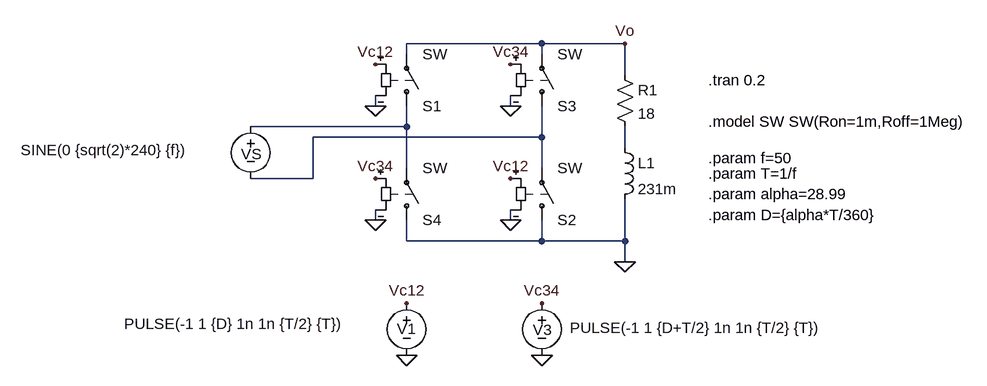
[diagram p0: schematic spfwcr-using-vcsw.asc]
spfwcr-using-vcsw.asc, the LTspice schematic file:
Version 4
SHEET 1 1700 680
WIRE 480 -48 272 -48
WIRE 608 -48 480 -48
WIRE 272 -32 272 -48
WIRE 480 -32 480 -48
WIRE 608 0 608 -48
WIRE 224 48 224 32
WIRE 432 48 432 32
WIRE 272 80 272 48
WIRE 272 80 32 80
WIRE 480 96 480 48
WIRE 480 96 128 96
WIRE 608 112 608 80
WIRE 272 144 272 80
WIRE 480 144 480 96
WIRE 128 160 128 96
WIRE 128 160 32 160
WIRE 224 224 224 208
WIRE 432 224 432 208
WIRE 272 256 272 224
WIRE 480 256 480 224
WIRE 480 256 272 256
WIRE 608 256 608 192
WIRE 608 256 480 256
WIRE 608 288 608 256
FLAG 608 288 0
FLAG 608 -48 Vo
FLAG 272 432 0
FLAG 272 352 Vc12
FLAG 224 48 0
FLAG 224 -16 Vc12
FLAG 432 160 Vc12
FLAG 432 224 0
FLAG 480 352 Vc34
FLAG 480 432 0
FLAG 432 -16 Vc34
FLAG 224 160 Vc34
FLAG 432 48 0
FLAG 224 224 0
SYMBOL voltage 32 64 R0
WINDOW 0 -15 58 Left 2
WINDOW 3 -354 52 Left 2
WINDOW 123 0 0 Left 0
WINDOW 39 0 0 Left 0
SYMATTR InstName VS
SYMATTR Value SINE(0 {sqrt(2)*240} {f})
SYMBOL res 592 -16 R0
SYMATTR InstName R1
SYMATTR Value 18
SYMBOL voltage 272 336 R0
WINDOW 3 -435 48 Left 2
WINDOW 123 0 0 Left 0
WINDOW 39 0 0 Left 0
WINDOW 0 -15 55 Left 2
SYMATTR Value PULSE(-1 1 {D} 1n 1n {T/2} {T})
SYMATTR InstName V1
SYMBOL voltage 480 336 R0
WINDOW 3 43 54 Left 2
WINDOW 0 -14 57 Left 2
WINDOW 123 0 0 Left 0
WINDOW 39 0 0 Left 0
SYMATTR Value PULSE(-1 1 {D+T/2} 1n 1n {T/2} {T})
SYMATTR InstName V3
SYMBOL ind 592 96 R0
SYMATTR InstName L1
SYMATTR Value 231m
SYMBOL sw 272 64 M180
SYMATTR InstName S1
SYMBOL sw 480 240 M180
SYMATTR InstName S2
SYMBOL sw 480 64 M180
SYMATTR InstName S3
SYMBOL sw 272 240 M180
SYMATTR InstName S4
TEXT 736 8 Left 2 !.tran 0.2
TEXT 736 184 Left 2 !.param alpha=28.99
TEXT 736 216 Left 2 !.param D={alpha*T/360}
TEXT 736 128 Left 2 !.param f=50
TEXT 736 152 Left 2 !.param T=1/f
TEXT 736 72 Left 2 !.model SW SW(Ron=1m,Roff=1Meg)

The netlist it stands for:
* spfwcr-using-vcsw.asc
VS N001 N002 SINE(0 {sqrt(2)*240} {f})
R1 Vo N003 18
V1 Vc12 0 PULSE(-1 1 {D} 1n 1n {T/2} {T})
V3 Vc34 0 PULSE(-1 1 {D+T/2} 1n 1n {T/2} {T})
L1 N003 0 231m
S1 N001 Vo Vc12 0 SW
S2 0 N002 Vc12 0 SW
S3 N002 Vo Vc34 0 SW
S4 0 N001 Vc34 0 SW
.tran 0.2
.param alpha=28.99
.param D={alpha*T/360}
.param f=50
.param T=1/f
.model SW SW(Ron=1m,Roff=1Meg)
.backanno
.end